# EasyEDA schematic ArduinoBootLoader-for-1284P-Shield.json
TITLE: Arduino UNO Shield - Atmega1284 Programming; REV: 1.0; Date: 2022-07-18; Sheet: 1/1; Drawn By: helmut-f; Company: Your Company
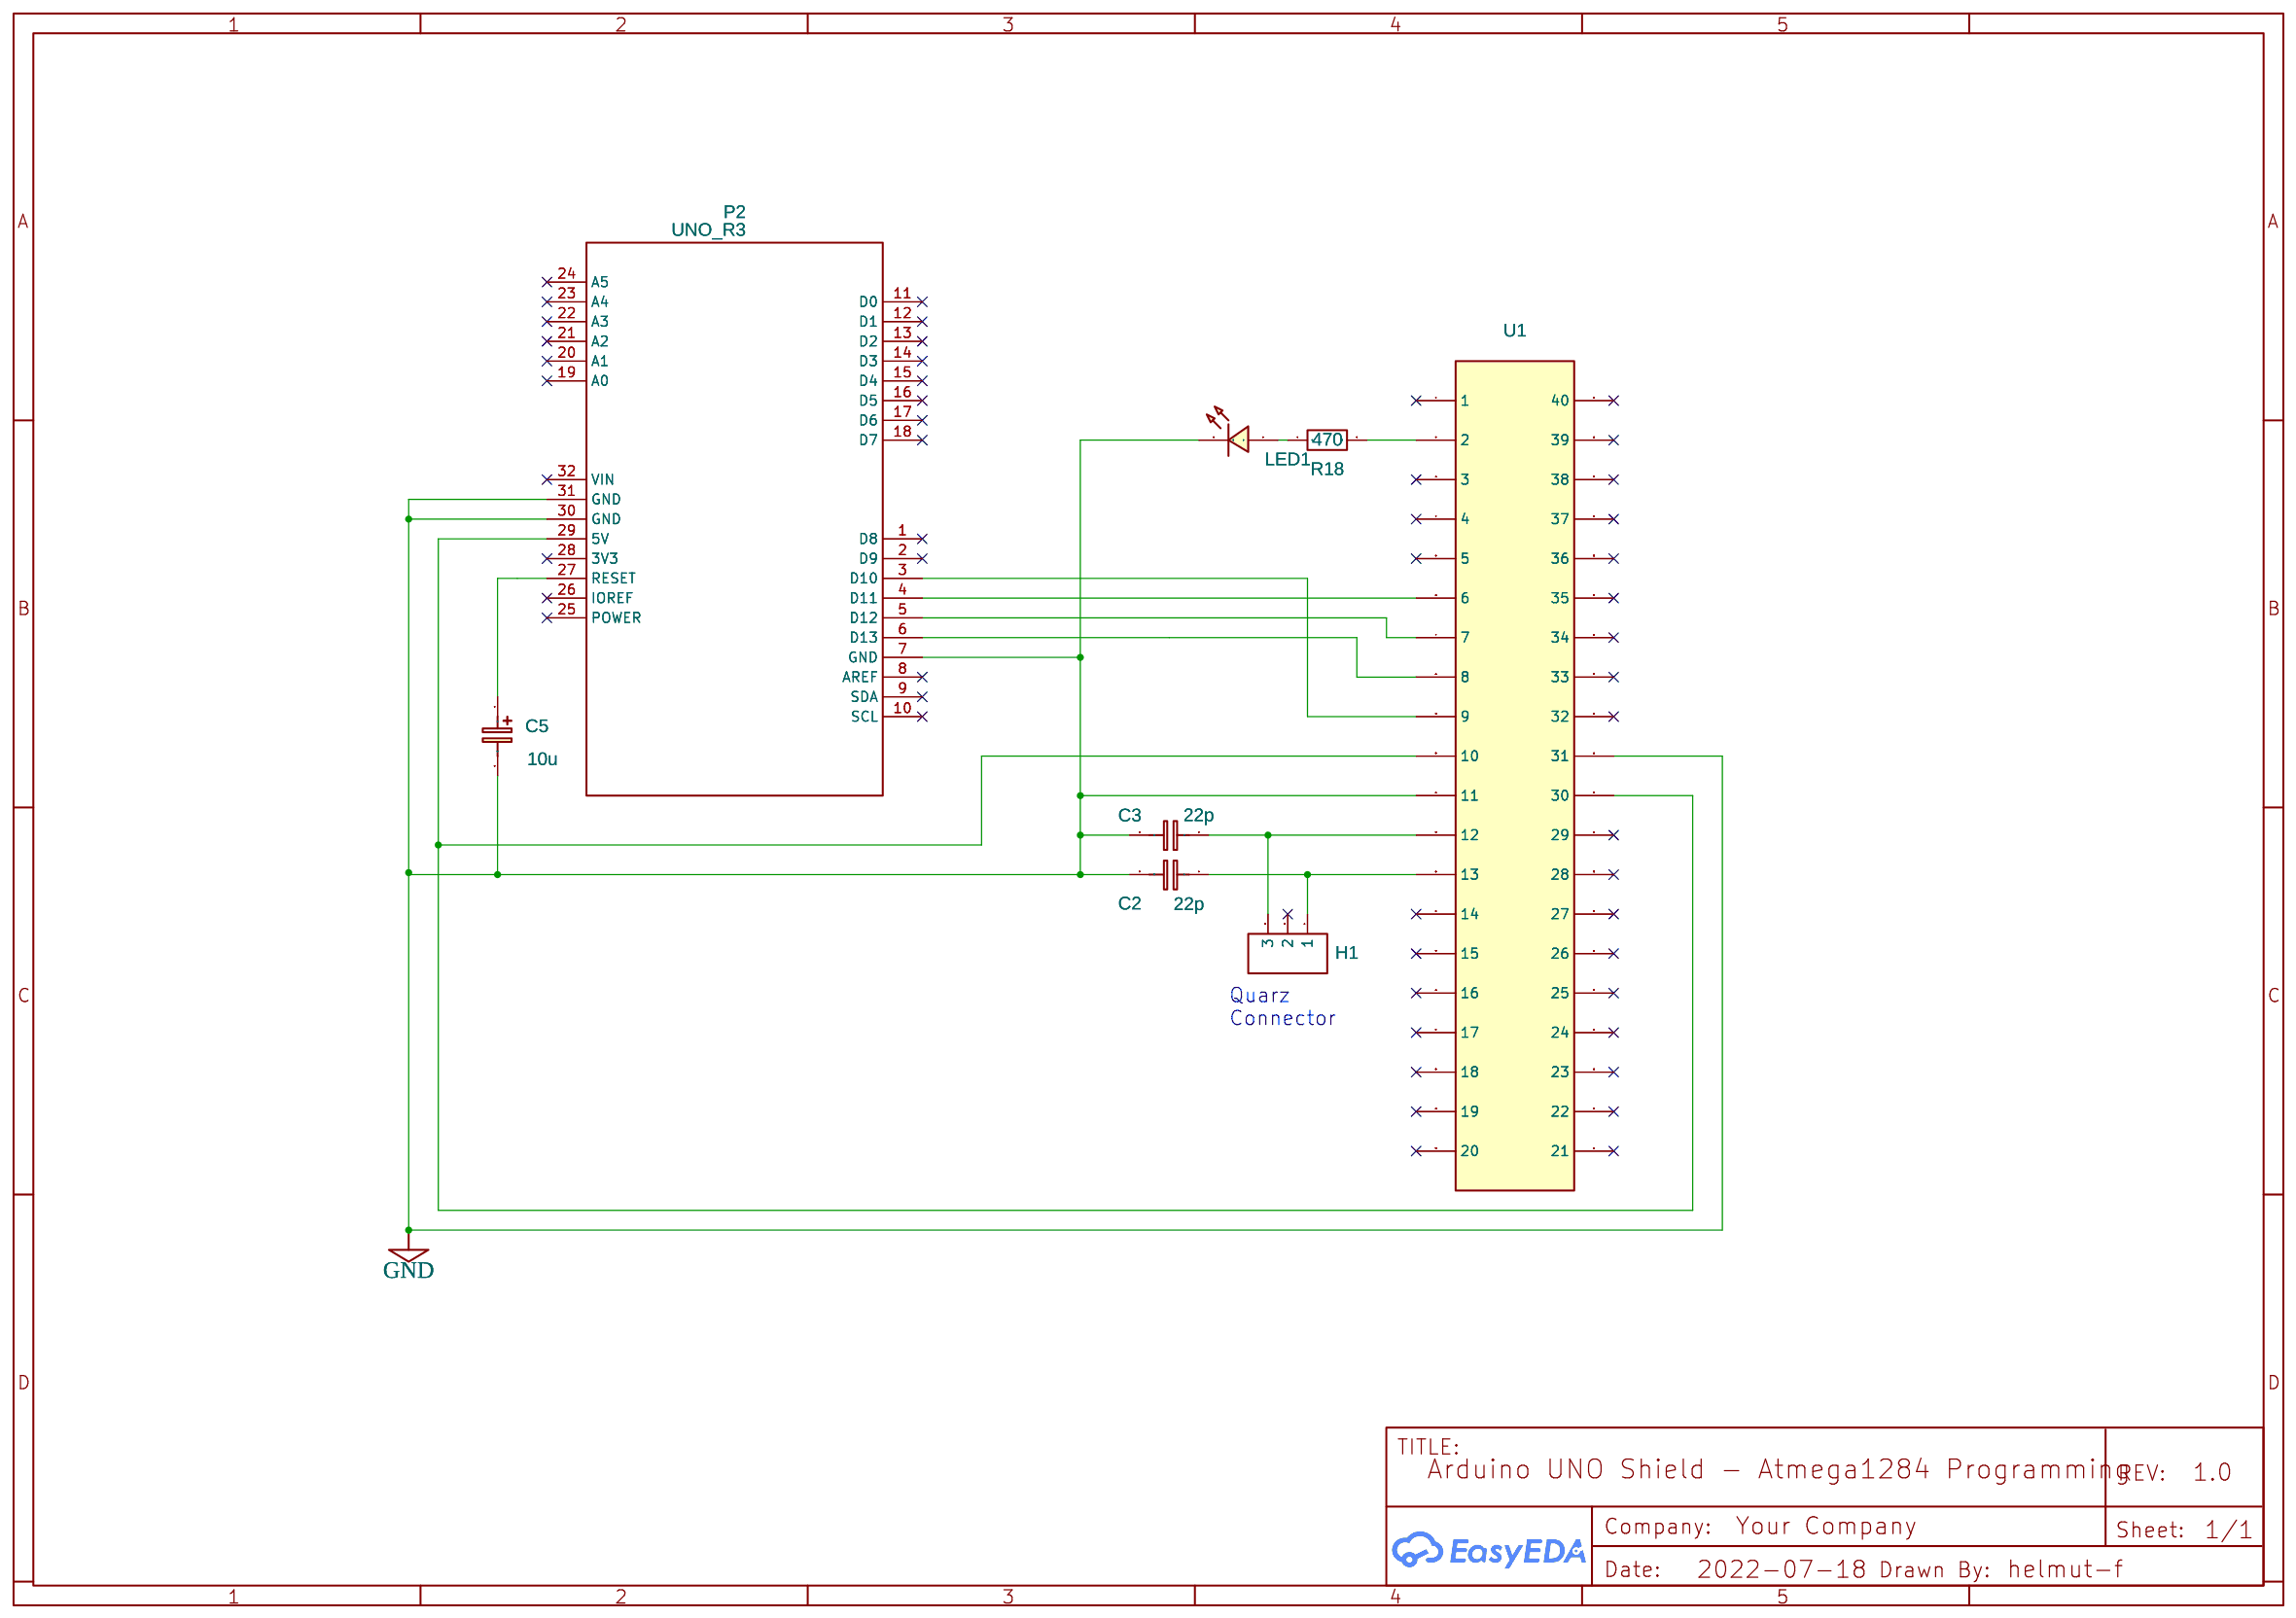
[diagram p0: schematic sheet]

## Parts
C2  22p  [RAD-0.1]
C3  22p  [RAD-0.1]
C5  10u  [CAP-D4.0×F1.5]
H1  HDR-F-2.54_1x3  [HDR-F-2.54_1X3]
LED1  LED-TH-3mm_R  [LED-TH_BD3.0_RED]
P2  UNO_R3  [UNO_R3]
R18  470  [R_AXIAL-0.3]
U1  DS1009-40AT1WX-0A2  [DIP-40_L52.3-W13.9-P2.54-LS15.2-BL-BASE]

## Library data of the parts
C2 C3 = C_0603_EU: Contributor: LCEDA_Lib; Package Display: No
C5 = CE_TH_D4.0×F1.5_EU: Contributor: LCEDA_Lib
H1 = HDR-F-2.54_1x3: Supplier Part: C146690; Supplier: LCSC; Contributor: LCEDA_Lib
LED1 = LED-TH-3mm_R: Manufacturer: EVERLIGHT(台湾亿光); Manufacturer Part: 204-10SDRD/S530-A3-L; Supplier Part: C84774; Supplier: LCSC; Contributor: LCEDA_Lib; Package Display: No
P2 = UNO_R3: sourceId: 1T5FDZYC8
R18 = R_AXIAL-0.3_EU: Contributor: LCEDA_Lib
U1 = DS1009-40AT1WX-0A2: Supplier: LCSC; Manufacturer: CONNFLY; Supplier Part: C72123; JLCPCB Part Class: Extended Part

## Nets
GND: C2.2 C3.2 C5.2 LED1.2 P2.7(GND) P2.30(GND) P2.31(GND) U1.11 U1.31
Net-(C2-1): C2.1 H1.1 U1.13
Net-(C3-1): C3.1 H1.3 U1.12
Net-(C5-1): C5.1 P2.27(RESET)
Net-(LED1-1): LED1.1 R18.1
Net-(P2-3): P2.3(D10) U1.9
Net-(P2-4): P2.4(D11) U1.6
Net-(P2-5): P2.5(D12) U1.7
Net-(P2-6): P2.6(D13) U1.8
Net-(P2-29): P2.29(5V) U1.10 U1.30
Net-(R18-2): R18.2 U1.2

Not connected (* = marked no-connect by the designer): H1 2*; P2 1(D8)* 2(D9)* 8(AREF)* 9(SDA)* 10(SCL)* 11(D0)* 12(D1)* 13(D2)* 14(D3)* 15(D4)* 16(D5)* 17(D6)* 18(D7)* 19(A0)* 20(A1)* 21(A2)* 22(A3)* 23(A4)* 24(A5)* 25(POWER)* 26(IOREF)* 28(3V3)* 32(VIN)*; U1 1* 3* 4* 5* 14* 15* 16* 17* 18* 19* 20* 21* 22* 23* 24* 25* 26* 27* 28* 29* 32* 33* 34* 35* 36* 37* 38* 39* 40*

## Notes on the sheet
- Quarz
  Connector
